# EAGLE schematic relay_pulvertech_lite (EAGLE 8.2.2)
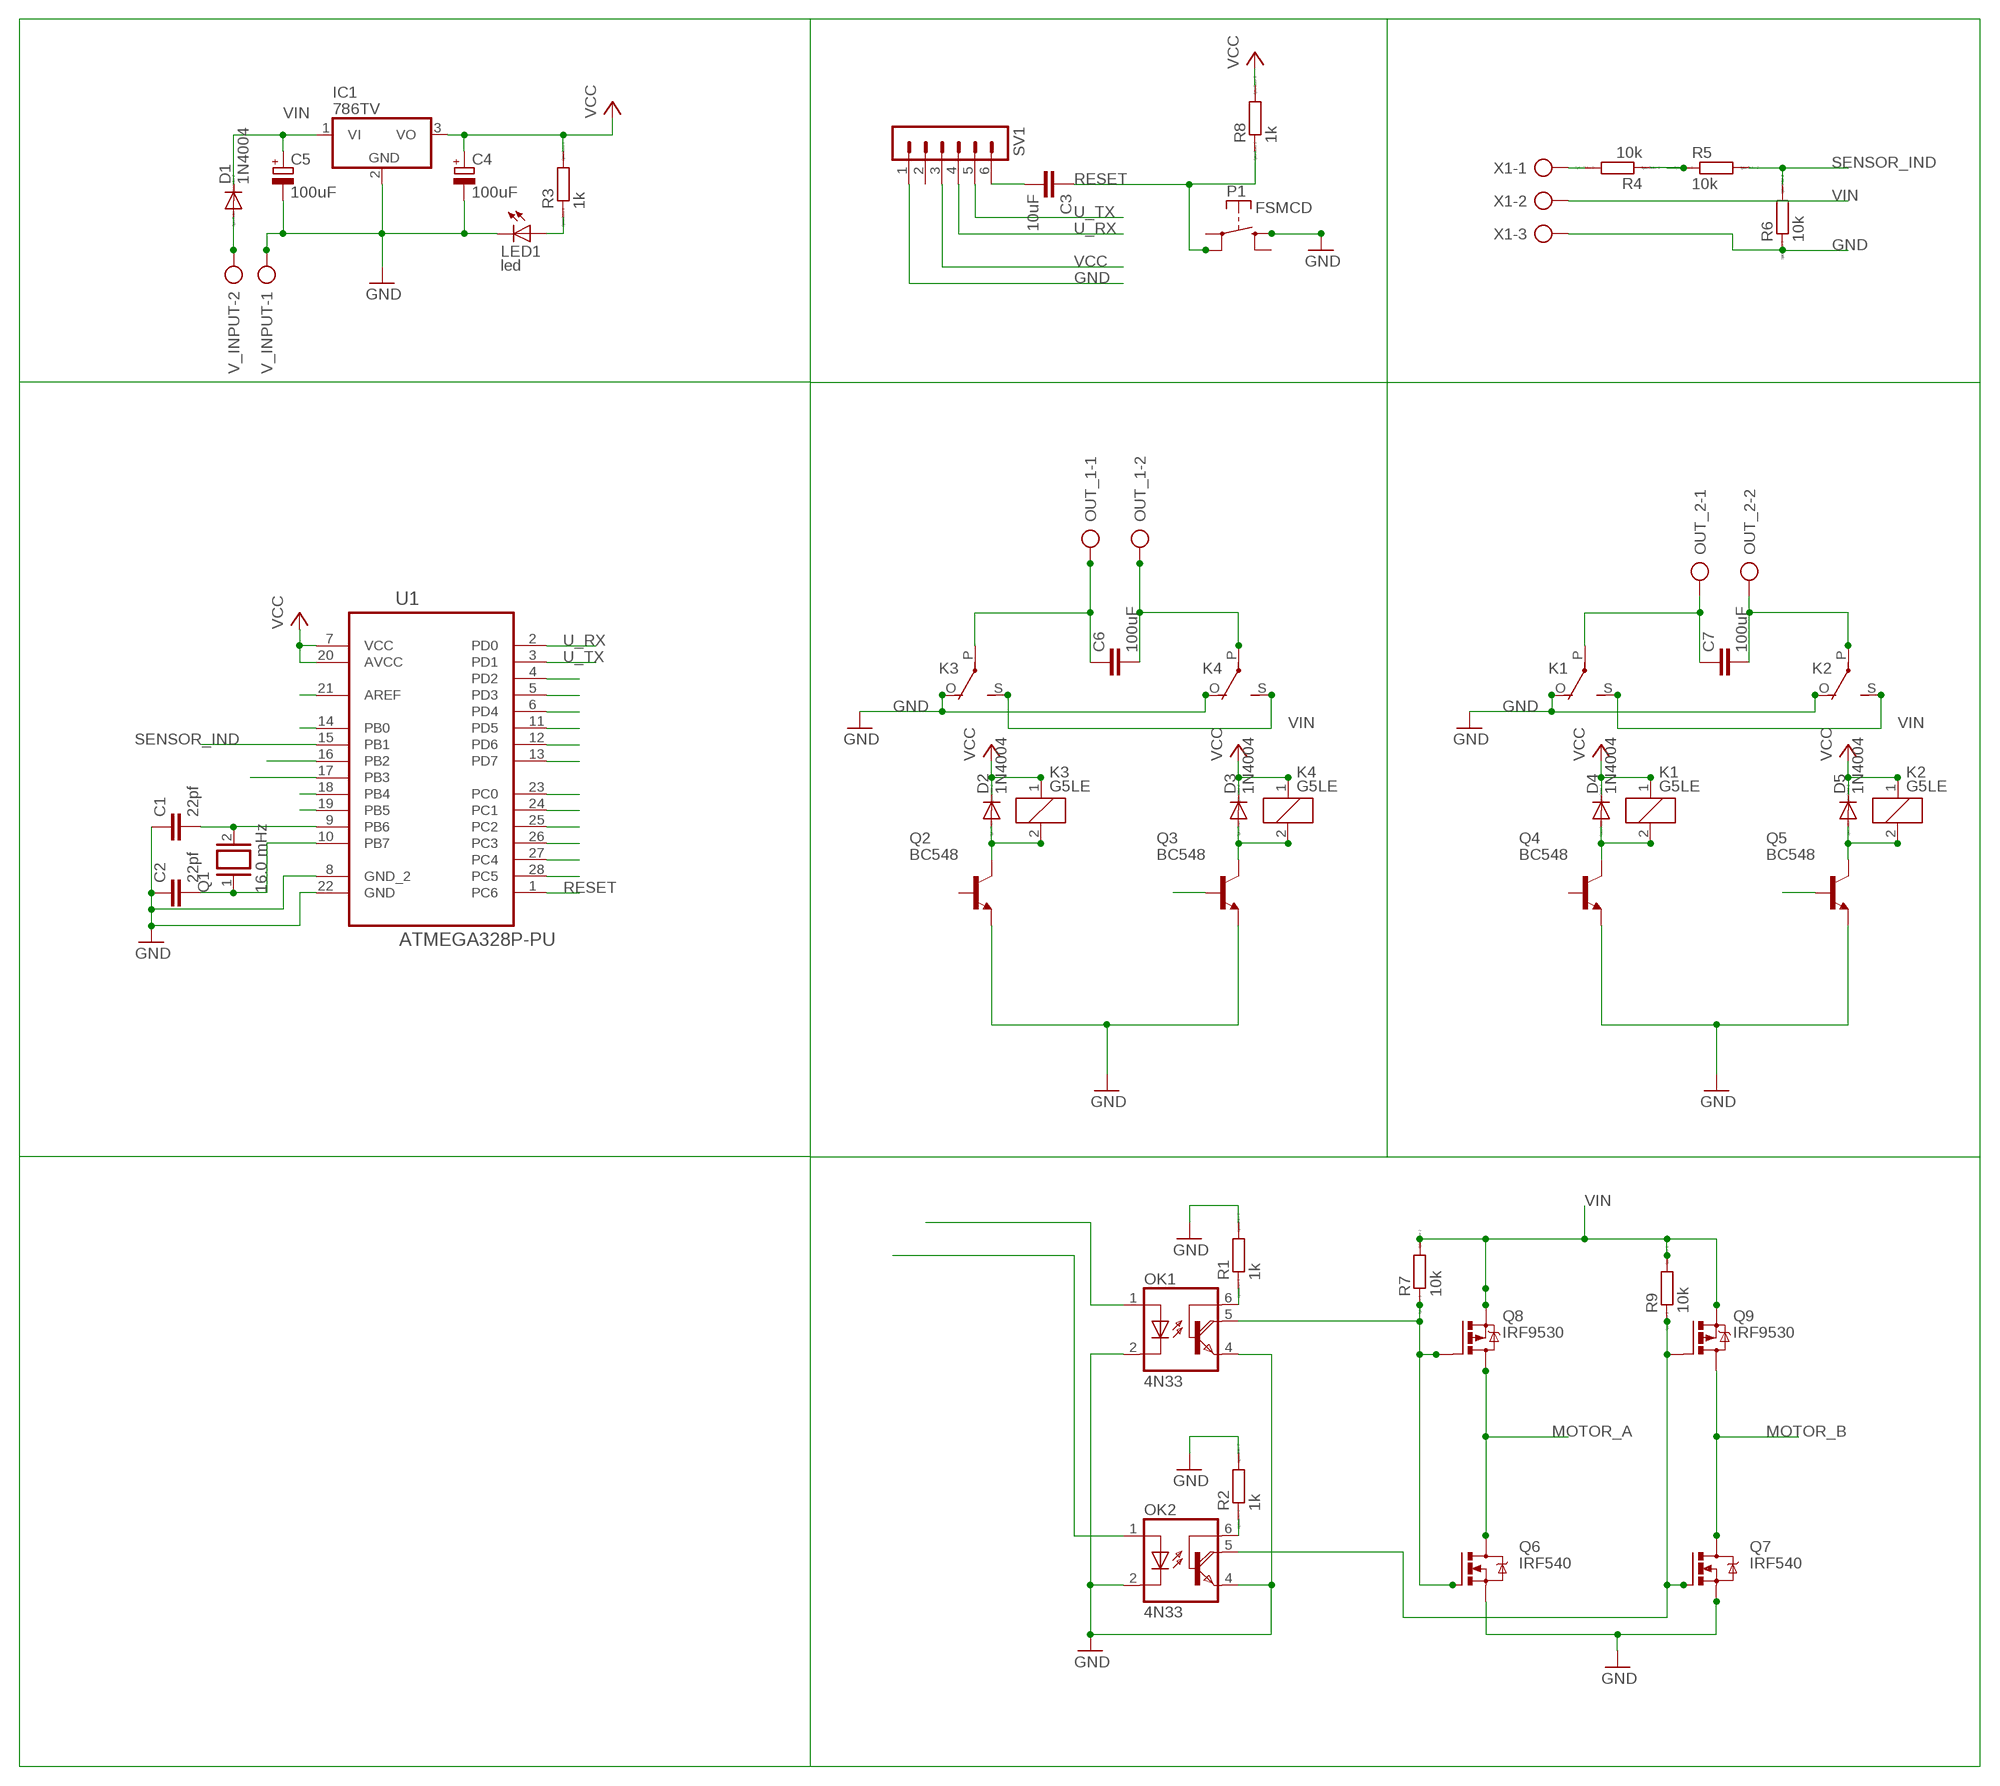
[diagram p0: schematic, sheet 1]

## Parts
C1  22pf  C-EU025-025X050  [C025-025X050]
C2  22pf  C-EU025-025X050  [C025-025X050]
C3  10uF  C-EU025-025X050  [C025-025X050]
C4  100uF  CPOL-EUE2.5-5  [E2,5-5]
C5  100uF  CPOL-EUE2.5-5  [E2,5-5]
C6  100uF  C2,5-3  [C2.5-3]
C7  100uF  C2,5-3  [C2.5-3]
D1  1N4004  [DO41-10]
D2  1N4004  [DO41-10]
D3  1N4004  [DO41-10]
D4  1N4004  [DO41-10]
D5  1N4004  [DO41-10]
IC1  786TV  [TO220V]
K1  G5LE  [G5LE]
K2  G5LE  [G5LE]
K3  G5LE  [G5LE]
K4  G5LE  [G5LE]
LED1  led  LED3MM  [LED3MM]
OK1  4N33  [DIL06]
OK2  4N33  [DIL06]
OUT_1  AK500/2-H  [AK500/2-H]
OUT_2  AK500/2-H  [AK500/2-H]
P1  FSMCD  [FSMCD]
Q1  16.0 mHz  XTAL/S  [QS]
Q2  BC548  [TO92-EBC]
Q3  BC548  [TO92-EBC]
Q4  BC548  [TO92-EBC]
Q5  BC548  [TO92-EBC]
Q6  IRF540  [TO220BV]
Q7  IRF540  [TO220BV]
Q8  IRF9530  [TO220BV]
Q9  IRF9530  [TO220BV]
R1  1k  R0204/7  [0204/7]
R2  1k  R0204/7  [0204/7]
R3  1k  R0204/7  [0204/7]
R4  10k  R0204/7  [0204/7]
R5  10k  R0204/7  [0204/7]
R6  10k  R0204/7  [0204/7]
R7  10k  R0204/7  [0204/7]
R8  1k  R0204/7  [0204/7]
R9  10k  R0204/7  [0204/7]
SV1  MA06-1  [MA06-1]
U1  ATMEGA328P-PU  [DIP254P762X457-28]
V_INPUT  AK500/2-H  [AK500/2-H]
X1  AK500/3-H  [AK500/3-H]

## Nets
GND: C1.1 C2.1 C4.- C5.- IC1.2(GND) K1.O(2:O) K2.O(2:O) K3.O(2:O) K4.O(2:O) LED1.K(C) OK1.2(C) OK1.4(E) OK2.2(C) OK2.4(E) P1.P$3(S) Q2.E Q3.E Q4.E Q5.E Q6.S Q7.S R1.2 R2.2 R6.1 SV1.1 U1.8(GND_2) U1.22(GND) V_INPUT.1 X1.3
GND1: C6.1 K3.P(2:P) OUT_1.1
GND2: C7.1 K1.P(2:P) OUT_2.1
MOTOR_A: Q6.D Q8.D
MOTOR_B: Q7.D Q9.D
N$1: C1.2 Q1.2 U1.9(PB6)
N$2: C2.2 Q1.1 U1.10(PB7)
N$3: OK1.1(A)
N$4: U1.16(PB2)
N$5: D1.A V_INPUT.2
N$6: OK2.1(A)
N$7: OK2.6(B) R2.1
N$8: C3.2 SV1.6
N$9: LED1.A R3.1
N$10: Q5.B
N$11: U1.21(AREF)
N$12: U1.14(PB0)
N$13: D2.A K3.2 Q2.C
N$14: U1.17(PB3)
N$15: U1.18(PB4)
N$16: D3.A K4.2 Q3.C
N$17: R4.2 X1.1
N$18: U1.19(PB5)
N$19: U1.4(PD2)
N$20: U1.5(PD3)
N$21: U1.6(PD4)
N$22: U1.11(PD5)
N$23: U1.12(PD6)
N$24: U1.13(PD7)
N$25: U1.23(PC0)
N$26: U1.24(PC1)
N$27: U1.25(PC2)
N$28: U1.26(PC3)
N$29: U1.27(PC4)
N$30: U1.28(PC5)
N$31: R4.1 R5.1
N$32: C6.2 K4.P(2:P) OUT_1.2
N$33: D4.A K1.2 Q4.C
N$34: D5.A K2.2 Q5.C
N$35: C7.2 K2.P(2:P) OUT_2.2
N$36: Q3.B
N$37: OK1.6(B) R1.1
N$38: OK1.5(COL) Q6.G Q8.G R7.1
N$39: OK2.5(COL) Q7.G Q9.G R9.1
RESET: C3.1 P1.P$2(P) R8.1 U1.1(PC6)
SENSOR_IND: R5.2 R6.2 U1.15(PB1)
U_RX: SV1.4 U1.2(PD0)
U_TX: SV1.5 U1.3(PD1)
VCC: C4.+ D2.C D3.C D4.C D5.C IC1.3(VO) K1.1 K2.1 K3.1 K4.1 R3.2 R8.2 SV1.3 U1.7(VCC) U1.20(AVCC)
VIN: C5.+ D1.C IC1.1(VI) K1.S(2:S) K2.S(2:S) K3.S(2:S) K4.S(2:S) Q8.S Q9.S R7.2 R9.2 X1.2
Unconnected: P1.P$1(P) P1.P$4(S) Q2.B Q4.B SV1.2

## Library data of the parts
C1-C3 = rcl:C-EU: CAPACITOR, European symbol
C4 C5 = resistor:CPOL-EU: POLARIZED CAPACITOR, European symbol
C6 C7 = capacitor-wima:C: CAPACITOR naming: grid - package width
D1-D5 = diode:1N4004: DIODE general purpose rectifier, 1 A
IC1 = linear:78*: Positive VOLTAGE REGULATOR Source: http://cache.national.com/ds/LM/LM78L05.pdf http://www.fairchildsemi.com/ds/LM/LM7805.pdf
K1-K4 = relay:G5LE: RELAY 1 x switch, 10 A/120 V AC, 8 A/30 V DC, Omron; OC_FARNELL: unknown; OC_NEWARK: unknown
LED1 = led:LED: LED OSRAM: - CHIPLED LG R971, LG N971, LY N971, LG Q971, LY Q971, LO R971, LY R971 LH N974, LH R974 LS Q976, LO Q976, LY Q976 LO Q996 - Hyper CHIPLED LW Q18S LB Q993, LB Q99A, LB R99A - SideLED LS A670, LO A670, LY A670, LG A670, LP A670 LB A673, LV A673, LT A673, LW A673 LH A674 LY A675 LS A676, LA A676, LO A676, LY A676, LW A676 LS A679, LY A679, LG A679 - Hyper Micro SIDELED® LS Y876, LA Y876, LO Y876, LY Y876 LT Y87S - SmartLED LW L88C, LW L88S LB L89C, LB L89S, LG L890 LS L89K, LO L89K, LY L89K LS L896, LA L896, LO L896, LY L896 - TOPLED LS T670, LO T670, LY T670, LG T670, LP T670 LSG T670, LSP T670, LSY T670, LOP T670, LYG T670 LG T671, LOG T671, LSG T671 LB T673, LV T673, LT T673, LW T673 LH T674 LS T676, LA T676, LO T676, LY T676, LB T676, LH T676, LSB T676, LW T676 LB T67C, LV T67C, LT T67C, LS T67K, LO T67K, LY T67K, LW E67C LS E67B, LA E67B, LO E67B, LY E67B, LB E67C, LV E67C, LT E67C LW T67C LS T679, LY T679, LG T679 LS T770, LO T770, LY T770, LG T770, LP T770 LB T773, LV T773, LT T773, LW T773 LH T774 LS E675, LA E675, LY E675, LS T675 LS T776, LA T776, LO T776, LY T776, LB T776 LHGB T686 LT T68C, LB T68C - Hyper Mini TOPLED® LB M676 - Mini TOPLED Santana® LG M470 LS M47K, LO M47K, LY M47K Source: http://www.osram.convergy.de LUXEON: - LUMILED® LXK2-PW12-R00, LXK2-PW12-S00, LXK2-PW14-U00, LXK2-PW14-V00 LXK2-PM12-R00, LXK2-PM12-S00, LXK2-PM14-U00 LXK2-PE12-Q00, LXK2-PE12-R00, LXK2-PE12-S00, LXK2-PE14-T00, LXK2-PE14-U00 LXK2-PB12-K00, LXK2-PB12-L00, LXK2-PB12-M00, LXK2-PB14-N00, LXK2-PB14-P00, LXK2-PB14-Q00 LXK2-PR12-L00, LXK2-PR12-M00, LXK2-PR14-Q00, LXK2-PR14-R00 LXK2-PD12-Q00, LXK2-PD12-R00, LXK2-PD12-S00 LXK2-PH12-R00, LXK2-PH12-S00 LXK2-PL12-P00, LXK2-PL12-Q00, LXK2-PL12-R00 Source: www.luxeon.com KINGBRIGHT: KA-3528ASYC Source: www.kingbright.com
OK1 OK2 = optocoupler:4N33: MOTOROLA OPTO COUPLER; MF: VISHAY/TELEFUNKEN; MPN: 4N33; OC_FARNELL: 1469601; OC_NEWARK: 88K1390
OUT_1 OUT_2 V_INPUT = con-ptr500:AK500/2-H: CONNECTOR Aug. 2004 / PTR Meßtechnik: Die Bezeichnung der Serie AK505 wurde geändert. Es handelt sich hierbei um AK500 in horizontaler Ausführung.; OC_FARNELL: unknown; OC_NEWARK: unknown
P1 = switch-misc:FSMCD: TYCO SWITCH
Q1 = special:XTAL/S: CRYSTAL
Q2-Q5 = transistor-npn:BC548*: NPN Transistor
Q6 Q7 = transistor-power:IRF540: HEXFET Power MOSFET
Q8 Q9 = transistor-power:IRF9530: P-CHANNEL HEXFET POWER-MOS-FET Source: http://www.irf.com/product-info/datasheets/data/irf9530.pdf
R1-R9 = eagle-ltspice:R: RESISTOR, European symbol; SPICEMODEL: NONE; SPICEPREFIX: R
SV1 = con-lstb:MA06-1: PIN HEADER; OC_FARNELL: unknown; OC_NEWARK: unknown
U1 = Atmel_By_element14_Batch_1-00:ATMEGA328P-PU: 8-bit Microcontroller with In-System Programmable Flash; MPN: ATMEGA328P-PU; OC_FARNELL: 1715487; OC_NEWARK: 15R0268; PACKAGE: PDIP-28; SUPPLIER: Atmel
X1 = con-ptr500:AK500/3-H: CONNECTOR Aug. 2004 / PTR Meßtechnik: Die Bezeichnung der Serie AK505 wurde geändert. Es handelt sich hierbei um AK500 in horizontaler Ausführung.; OC_FARNELL: unknown; OC_NEWARK: unknown

## Net classes
0 default: width 0.813 mm